# EAGLE design LibreServo-v2.1 (EAGLE 7.6.0)
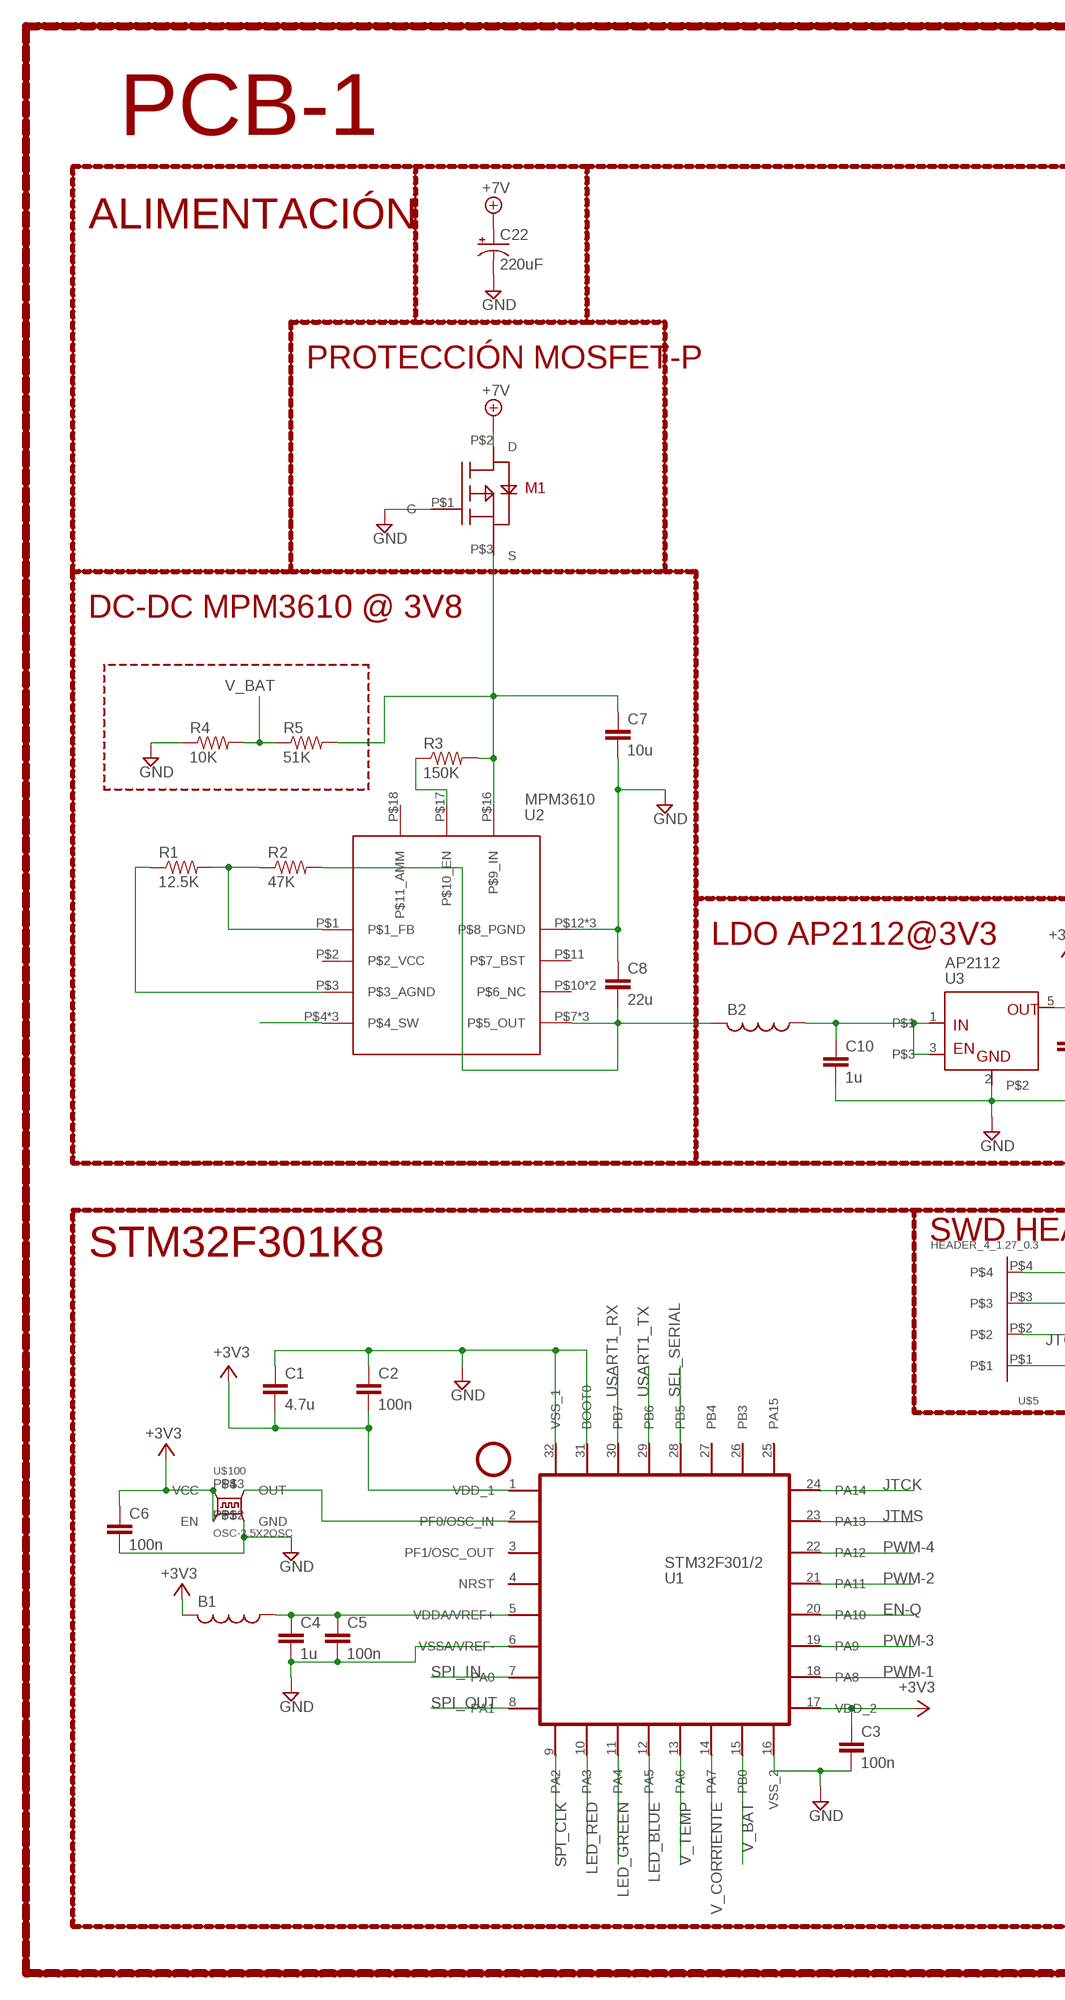
[diagram p0: schematic, sheet 1, part 1 of 2]
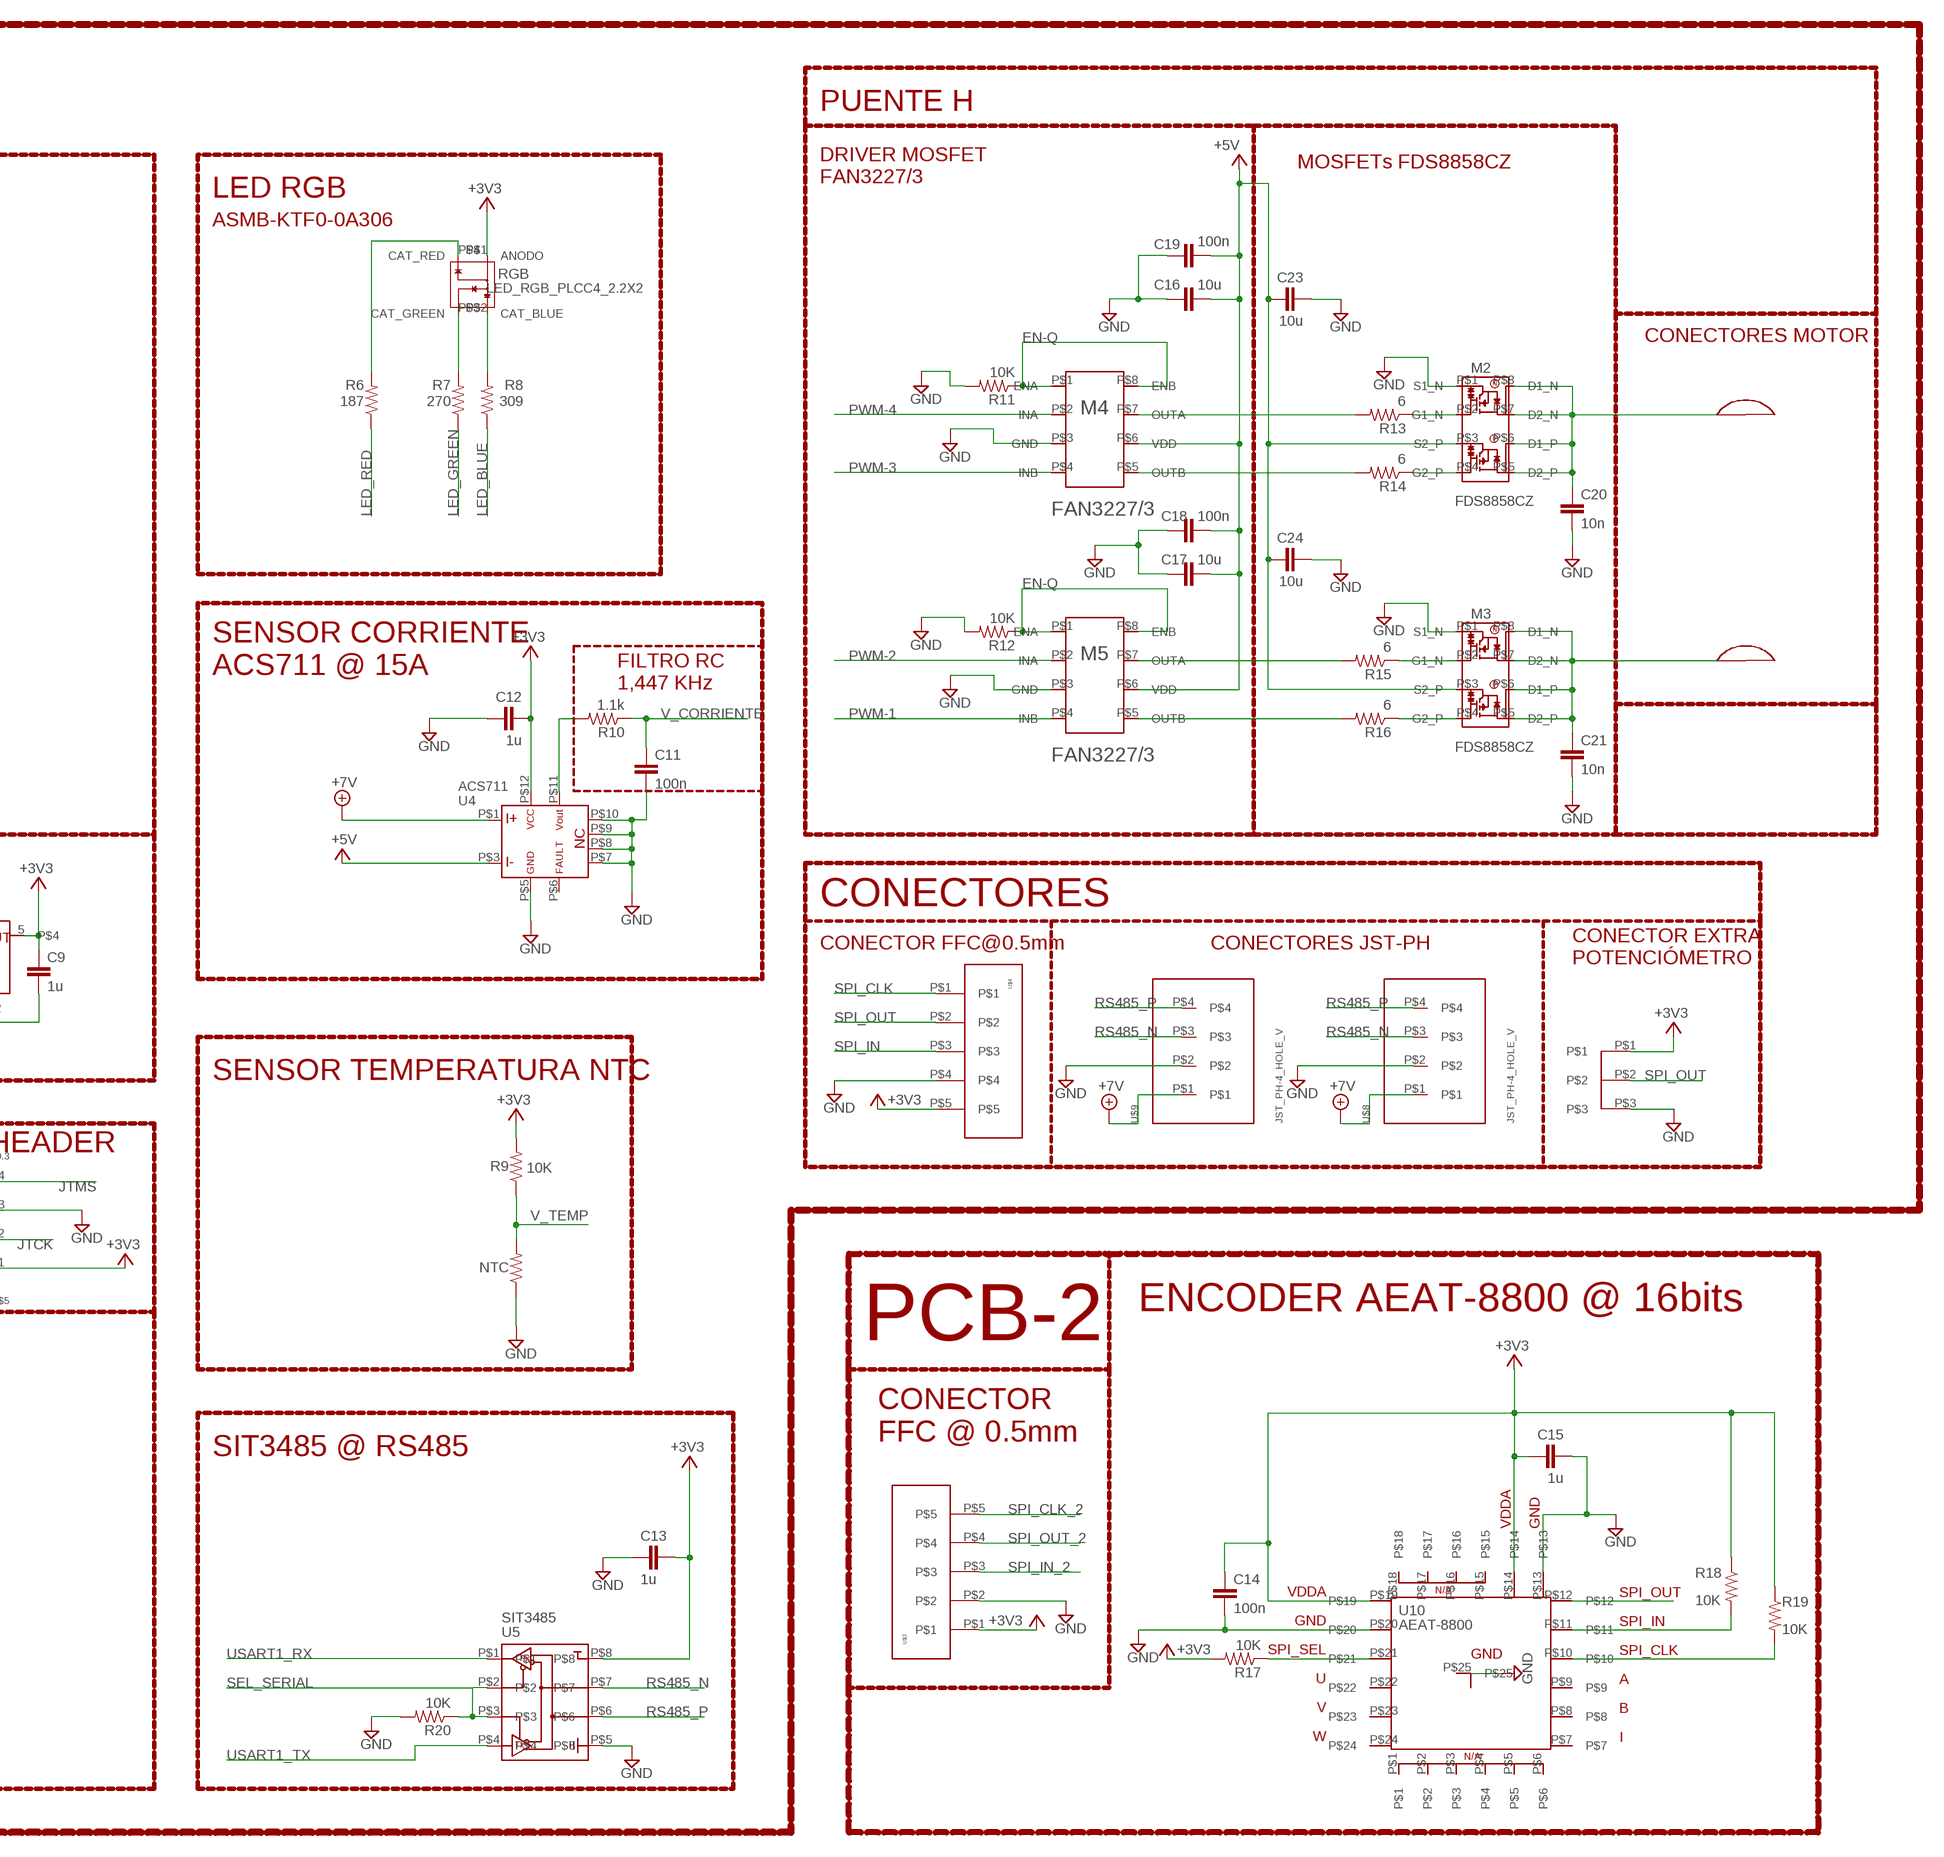
[diagram p1: schematic, sheet 1, part 2 of 2]

## Parts
B1  FERRITE_BEAD_0402  [0402]
B2  FERRITE_BEAD_0603  [0603]
C1  4.7u  C-EU0402  [0402]
C2  100n  C-EU0402  [0402]
C3  100n  C-EU0402  [0402]
C4  1u  C-EU0402  [0402]
C5  100n  C-EU0402  [0402]
C6  100n  C-EU0402  [0402]
C7  10u  C-EU0603  [0603]
C8  22u  C-EU1206  [1206]
C9  1u  C-EU0402  [0402]
C10  1u  C-EU0402  [0402]
C11  100n  C-EU0402  [0402]
C12  1u  C-EU0402  [0402]
C13  1u  C-EU0402  [0402]
C14  100n  C-EU0402  [0402]
C15  1u  C-EU0402  [0402]
C16  10u  C-EU0603  [0603]
C17  10u  C-EU0603  [0603]
C18  100n  C-EU0402  [0402]
C19  100n  C-EU0402  [0402]
C20  10n  C-EU0402  [0402]
C21  10n  C-EU0402  [0402]
C22  220uF  CPOL-USE2.5-6  [E2,5-6]
C23  10u  C-EU0603  [0603]
C24  10u  C-EU0603  [0603]
M1  M1  P5103EMA  [SOT23]
M2  FDS8858CZ  [SO-8]
M3  FDS8858CZ  [SO-8]
M4  FAN3227/3  [MLP8]
M5  FAN3227/3  [MLP8]
NTC  R-US0402_MIN  [0402_MIN]
R1  12.5K  R-US0402  [0402]
R2  47K  R-US0402  [0402]
R3  150K  R-US0402  [0402]
R4  10K  R-US0402  [0402]
R5  51K  R-US0402  [0402]
R6  187  R-US0402  [0402]
R7  270  R-US0402  [0402]
R8  309  R-US0402  [0402]
R9  10K  R-US0402  [0402]
R10  1.1k  R-US0402  [0402]
R11  10K  R-US0402  [0402]
R12  10K  R-US0402  [0402]
R13  6  R-US0402  [0402]
R14  6  R-US0402  [0402]
R15  6  R-US0402  [0402]
R16  6  R-US0402  [0402]
R17  10K  R-US0402  [0402]
R18  10K  R-US0402  [0402]
R19  10K  R-US0402  [0402]
R20  10K  R-US0402  [0402]
RGB  LED_RGB_PLCC4_2.2X2  [PLCC-4_2.2X2]
U1  STM32F301/2  STM32F302  [QFN32]
U2  MPM3610  MPM36XX  [MPM36XX]
U3  AP2112  [SOT25]
U4  ACS711  [ACS711-QFN]
U5  SIT3485  RS485-HALF_DUPLEX  [MSOP-8]
U10  AEAT-8800  [QFN24]
U$1  SLOT  [SERVO_SLOT]
U$2  SLOT  [SERVO_SLOT]
U$3  FFC-5  [FFC-5-0.5]
U$4  FFC-5  [FFC-5-0.5]
U$5  HEADER_4_1.27_0.3  [HEADER_4_1.27_0.3]
U$6  POTEN_SERVO  [POTEN_SERVO]
U$8  JST_PH-4_HOLE_V  [JST_PH-4_HOLEV]
U$9  JST_PH-4_HOLE_V  [JST_PH-4_HOLEV]
U$100  OSC-2.5X2OSC  [OSC-2.5X2]

## Nets
711_OUT: R10.2 U4.P$11
+3V3: B1.2 C1.2 C2.2 C3.1 C6.1 C9.1 C12.2 C13.2 R9.2 RGB.P$1(ANODO) U1.1(VDD_1) U1.17(VDD_2) U3.5 U4.P$12 U5.P$8 U$4.P$5 U$5.P$1 U$6.P$1 U$100.P$1(EN) U$100.P$4(VCC)
+3V3_2: C14.1 C15.1 R17.2 R18.1 R19.1 U10.P$14 U10.P$19 U$3.P$1 ; supply symbol labelled +3V3
+5V: C16.2 C17.2 C18.2 C19.2 C23.1 C24.1 M2.P$3(S2_P) M3.P$3(S2_P) M4.P$6(VDD) M5.P$6(VDD) U4.P$3
+7V: C22.+ M1.P$2(D) U4.P$1 U$8.P$1 U$9.P$1
CLK-8MHZ: U1.2(PF0/OSC_IN) U$100.P$3(OUT)
EN-Q: M4.P$1(ENA) M4.P$8(ENB) M5.P$1(ENA) M5.P$8(ENB) R11.1 R12.1 U1.20(PA10)
GND: C1.1 C2.1 C3.2 C4.2 C5.2 C6.2 C7.2 C8.1 C9.2 C10.2 C11.2 C12.1 C13.1 C16.1 C17.1 C18.1 C19.1 C20.2 C21.2 C22.- C23.2 C24.2 M1.P$1(G) M2.P$1(S1_N) M3.P$1(S1_N) M4.P$3(GND) M5.P$3(GND) NTC.1 R4.1 R11.2 R12.2 R20.2 U1.6(VSSA/VREF-) U1.16(VSS_2) U1.31(BOOT0) U1.32(VSS_1) U2.P$12(P$8_PGND) U2.P$13(P$8_PGND) U2.P$14(P$8_PGND) U3.2 U4.P$5 U4.P$7 U4.P$8 U4.P$9 U4.P$10 U5.P$5 U$4.P$4 U$5.P$3 U$6.P$3 U$8.P$2 U$9.P$2 U$100.P$2(GND)
GND_2: C14.2 C15.2 U10.P$13 U10.P$20 U10.P$25 U$3.P$2 ; supply symbol labelled GND
IN_AP2112: B2.1 C10.1 U3.1 U3.3
JTCK: U1.24(PA14) U$5.P$2
JTMS: U1.23(PA13) U$5.P$4
LED_BLUE: R8.1 U1.12(PA5)
LED_GREEN: R7.1 U1.11(PA4)
LED_RED: R6.1 U1.10(PA3)
M1-OUT: C7.1 M1.P$3(S) R3.2 R5.2 U2.P$16(P$9_IN)
M2-OUT: C20.1 M2.P$5(D2_P) M2.P$6(D1_P) M2.P$7(D2_N) M2.P$8(D1_N) U$1.P$1
M3-OUT: C21.1 M3.P$5(D2_P) M3.P$6(D1_P) M3.P$7(D2_N) M3.P$8(D1_N) U$2.P$1
M4-OUTA: M4.P$7(OUTA) R13.2
M4-OUTA-IN: M2.P$2(G1_N) R13.1
M4-OUTB: M4.P$5(OUTB) R14.2
M4-OUTB-IN: M2.P$4(G2_P) R14.1
M5-OUTA: M5.P$7(OUTA) R15.2
M5-OUTA-IN: M3.P$2(G1_N) R15.1
M5-OUTB: M5.P$5(OUTB) R16.2
M5-OUTB-IN: M3.P$4(G2_P) R16.1
MPM3610_AGND: R1.1 U2.P$3(P$3_AGND)
MPM3610_EN: R3.1 U2.P$17(P$10_EN)
MPM3610_FB: R1.2 R2.1 U2.P$1(P$1_FB)
MPM3610_SW: U2.P$4(P$4_SW) U2.P$5(P$4_SW) U2.P$6(P$4_SW)
N$1: R6.2 RGB.P$4(CAT_RED)
N$4: R7.2 RGB.P$3(CAT_GREEN)
N$5: R8.2 RGB.P$2(CAT_BLUE)
N$17: R17.1 U10.P$21
OUT_MPM3610: B2.2 C8.2 R2.2 U2.P$7(P$5_OUT) U2.P$8(P$5_OUT) U2.P$9(P$5_OUT)
PWM-1: M5.P$4(INB) U1.18(PA8)
PWM-2: M5.P$2(INA) U1.21(PA11)
PWM-3: M4.P$4(INB) U1.19(PA9)
PWM-4: M4.P$2(INA) U1.22(PA12)
RS485_N [Diff]: U5.P$7 U$8.P$3 U$9.P$3
RS485_P [Diff]: U5.P$6 U$8.P$4 U$9.P$4
SEL_SERIAL: R20.1 U1.28(PB5) U5.P$2 U5.P$3
SPI_CLK: U1.9(PA2) U$4.P$1
SPI_CLK_2: R19.2 U10.P$10 U$3.P$5
SPI_IN: U1.7(PA0) U$4.P$3
SPI_IN_2: R18.2 U10.P$11 U$3.P$3
SPI_OUT: U1.8(PA1) U$4.P$2 U$6.P$2
SPI_OUT_2: U10.P$12 U$3.P$4
USART1_RX: U1.30(PB7) U5.P$1
USART1_TX: U1.29(PB6) U5.P$4
V_BAT: R4.2 R5.1 U1.15(PB0)
V_CORRIENTE: C11.1 R10.1 U1.14(PA7)
V_TEMP: NTC.2 R9.1 U1.13(PA6)
VDDA-FILTRADO: B1.1 C4.1 C5.1 U1.5(VDDA/VREF+)
Unconnected: U1.3(PF1/OSC_OUT) U1.4(NRST) U1.25(PA15) U1.26(PB3) U1.27(PB4) U2.P$2(P$2_VCC) U2.P$10(P$6_NC) U2.P$11(P$7_BST) U2.P$15(P$6_NC) U2.P$18(P$11_AMM) U4.P$6 U10.P$1 U10.P$2 U10.P$3 U10.P$4 U10.P$5 U10.P$6 U10.P$7 U10.P$8 U10.P$9 U10.P$15 U10.P$16 U10.P$17 U10.P$18 U10.P$22 U10.P$23 U10.P$24 U$1.P$2 U$2.P$2

## Notes on the sheet
- PUENTE H
- PCB-1
- MOSFETs FDS8858CZ
- DRIVER MOSFET
  FAN3227/3
- LED RGB
- ALIMENTACIÓN
- ASMB-KTF0-0A306
- PROTECCIÓN MOSFET-P | CONECTORES MOTOR
- M1
- DC-DC MPM3610 @ 3V8
- SENSOR CORRIENTE
  ACS711 @ 15A
- FILTRO RC
  1,447 KHz
- LDO AP2112@3V3
- CONECTORES
- CONECTOR FFC@0.5mm | CONECTORES JST-PH
- CONECTOR EXTRA
  POTENCIÓMETRO
- SENSOR TEMPERATURA NTC
- SWD HEADER
- STM32F301K8
- ENCODER AEAT-8800 @ 16bits
- PCB-2
- CONECTOR
  FFC @ 0.5mm
- SIT3485 @ RS485

## Library data of the parts
B1 = Propio:FERRITE_BEAD_0402
B2 = Propio:FERRITE_BEAD_0603
C1-C21 C23 C24 = Propio:C-EU
C22 = rcl:CPOL-US: POLARIZED CAPACITOR, American symbol
M1 = Propio:P5103EMA
M2 M3 = Propio:FDS8858CZ
M4 M5 = Propio:FAN3227/3
NTC R1-R20 = Propio:R-US
RGB = Propio:LED_RGB_PLCC4_2.2X2
U1 = Propio:STM32F302
U2 = Propio:MPM36XX
U3 = Propio:AP2112
U4 = Propio:ACS711
U5 = Propio:RS485-HALF_DUPLEX
U10 = Propio:AEAT-8800
U$1 U$2 = Propio:SLOT
U$3 U$4 = Propio:FFC-5
U$5 = Propio:HEADER_4
U$6 = Propio:POTEN_SERVO
U$8 U$9 = Propio:JST_PH-4_HOLE
U$100 = Propio:OSC-2.5X2

## Net classes
1 Diff: width 0.178 mm, clearance 0.152 mm

## Board
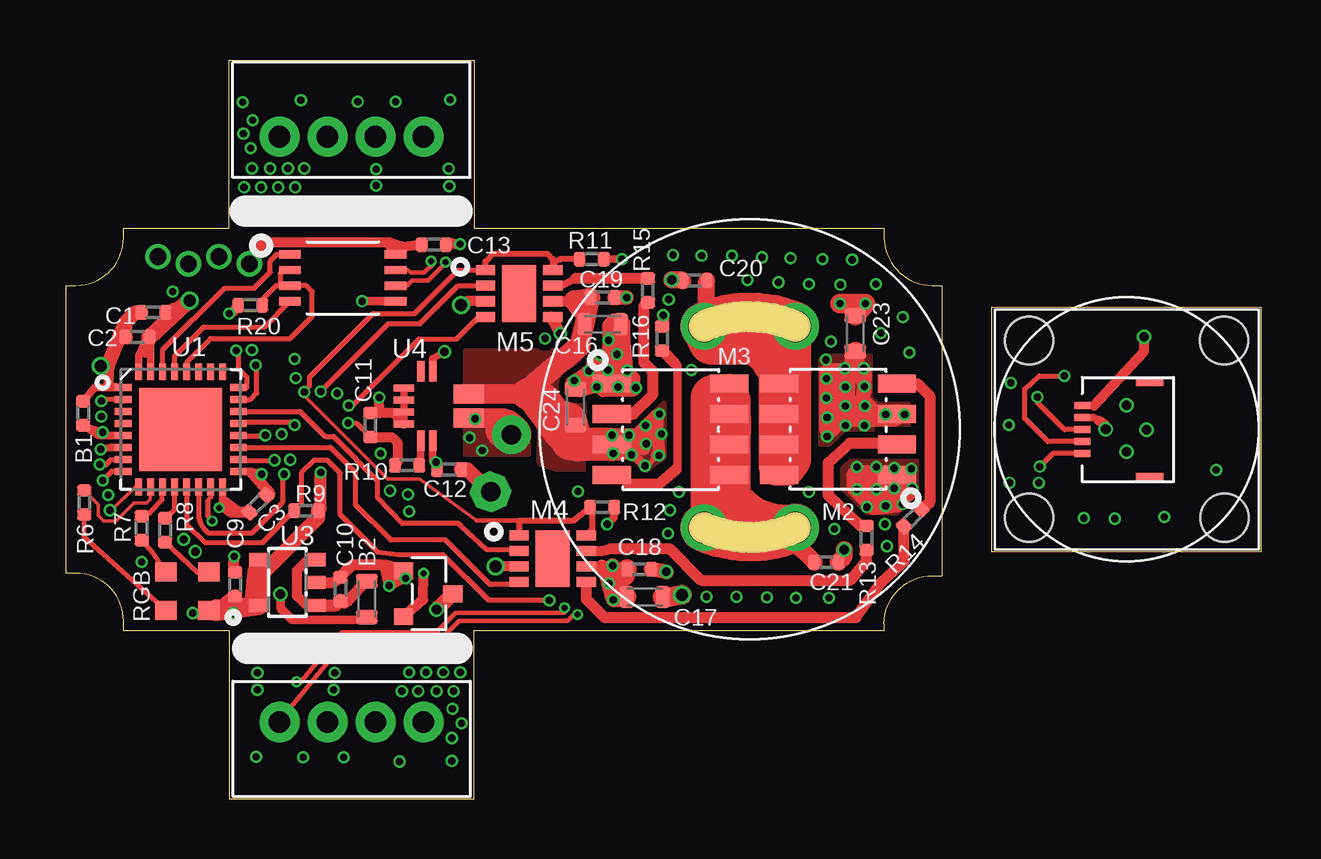
[diagram p2: board, top side]
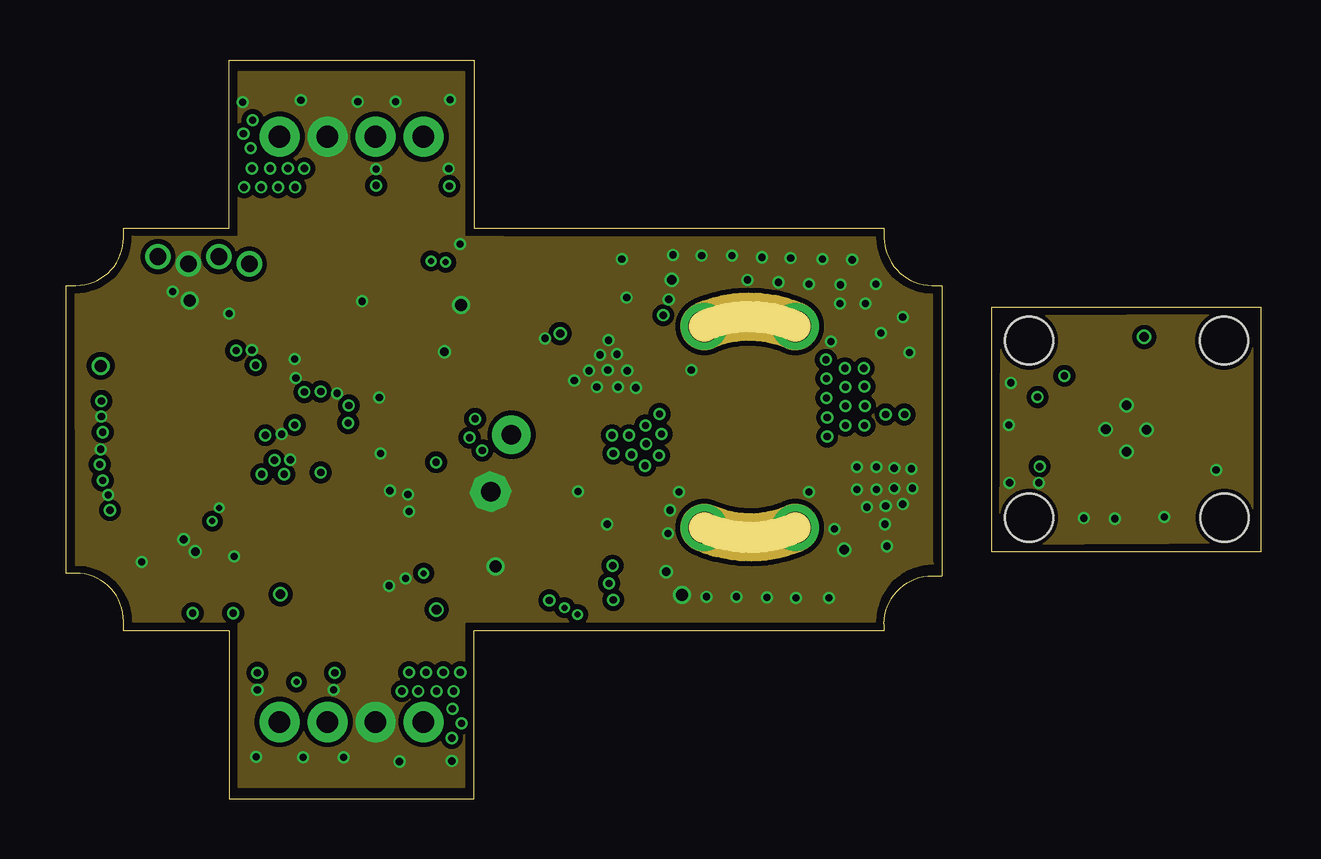
[diagram p3: board, inner layer Route2]
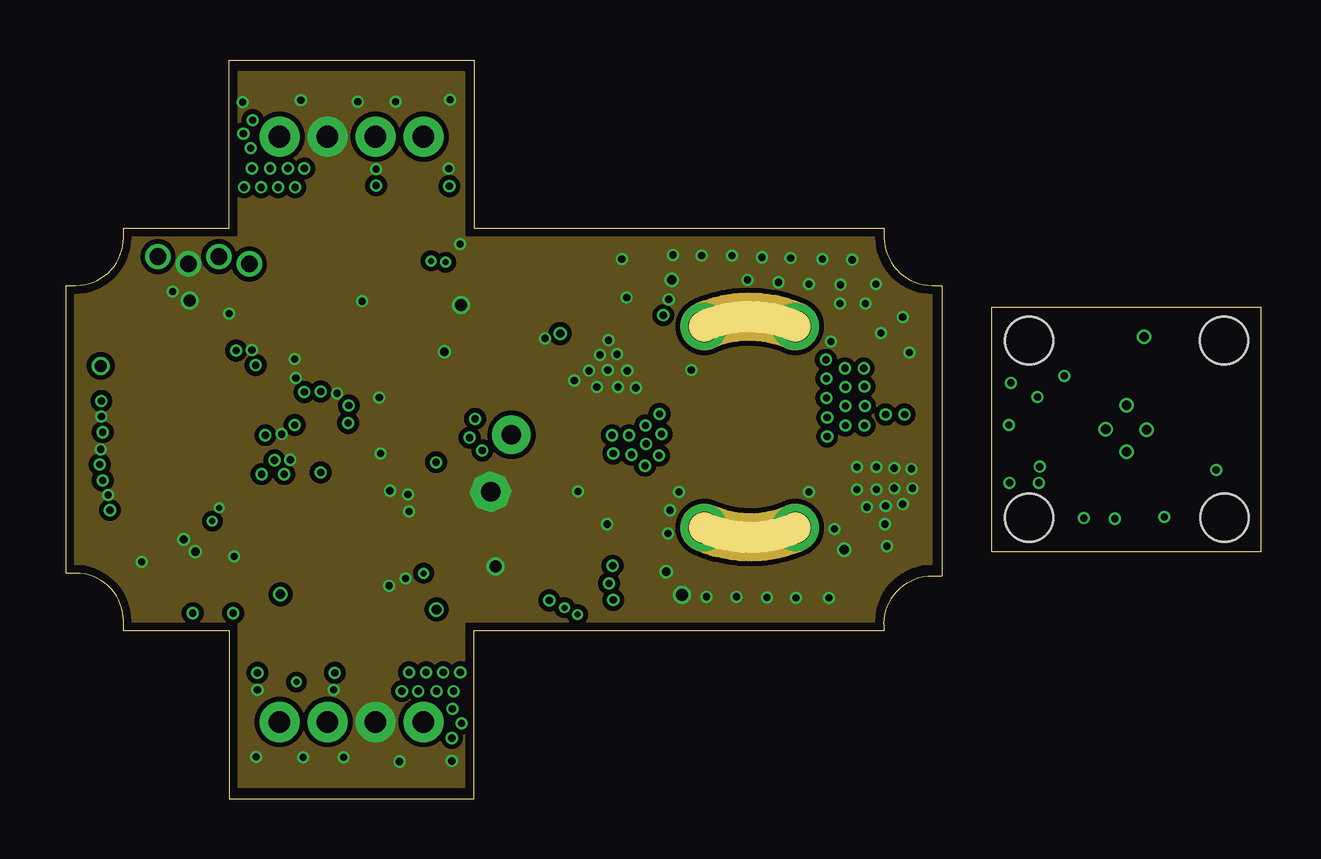
[diagram p4: board, inner layer Route3]
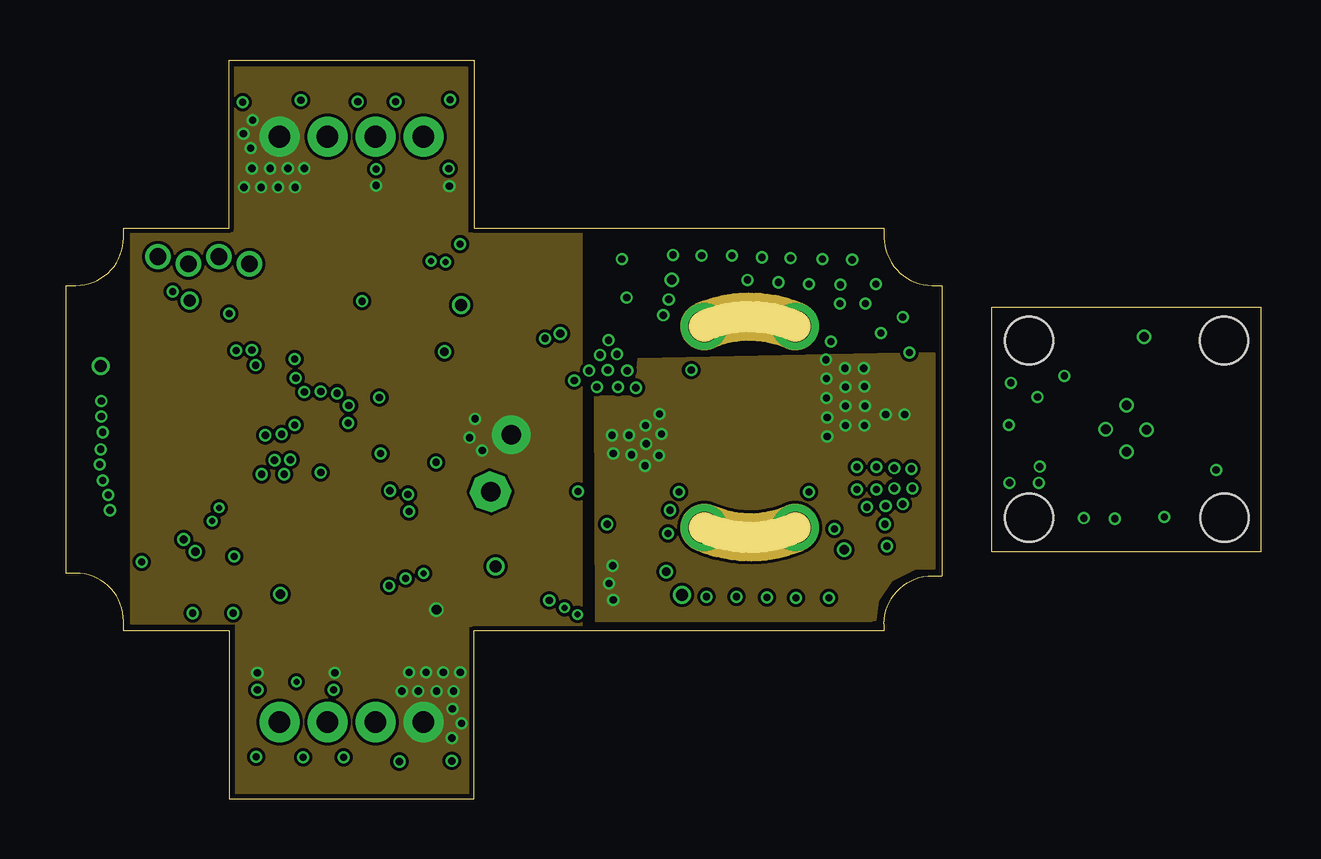
[diagram p5: board, inner layer Route14]
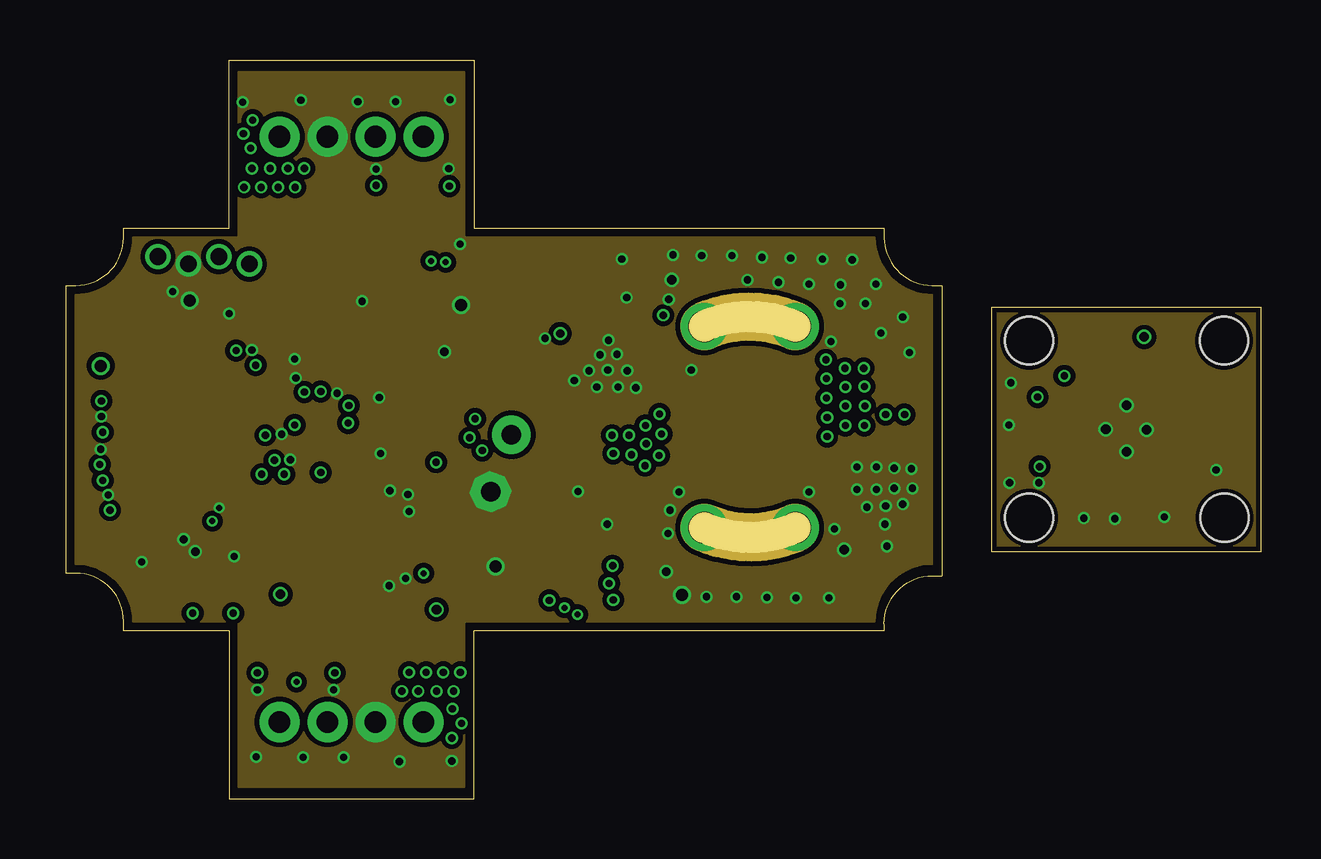
[diagram p6: board, inner layer Route15]
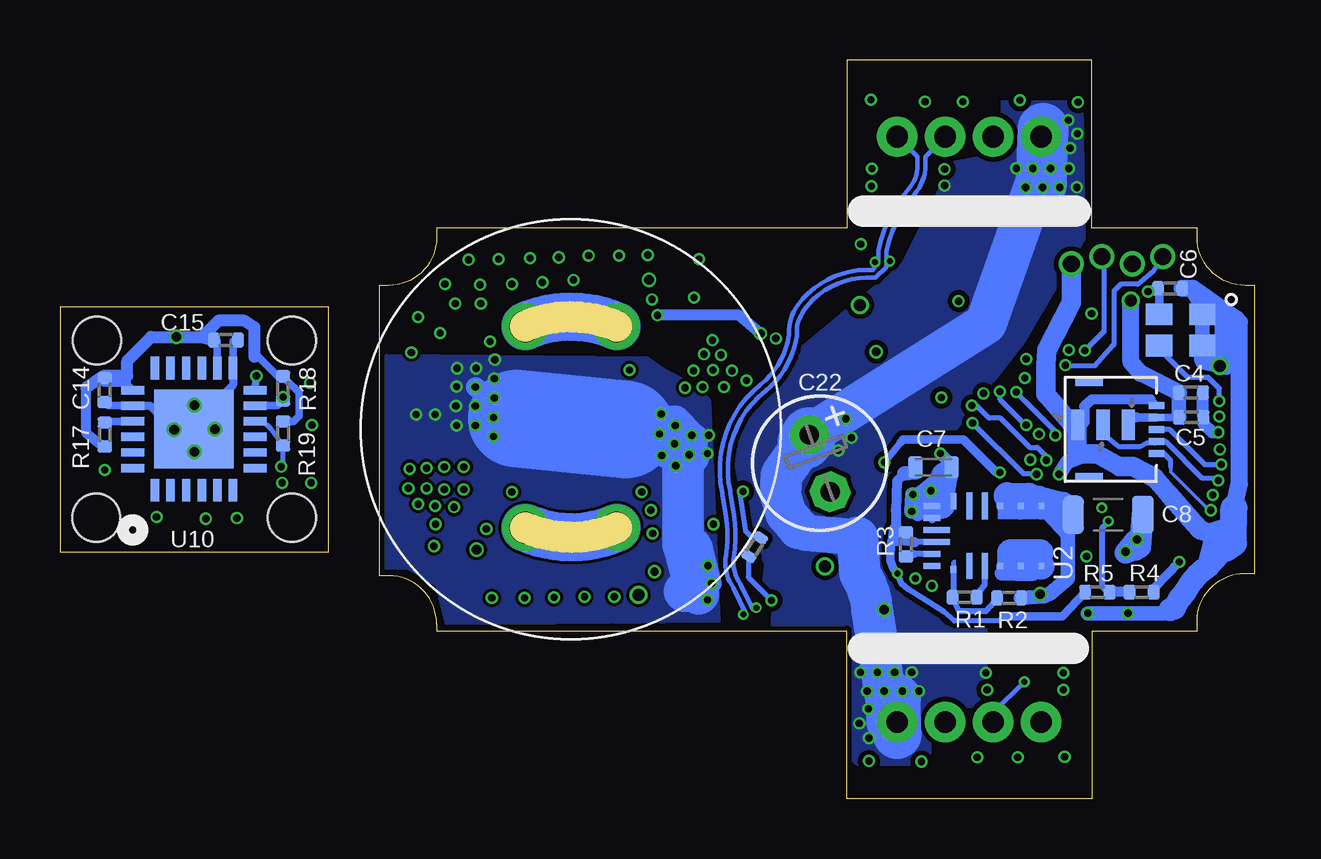
[diagram p7: board, bottom side, seen from below]

Size 49.8 x 30.8 mm. Coordinates in mm from the lower left corner, seen from the top.
Outline: 2.4,7.4 arc90 0.4,9.4 0,9.4 0,21.4 0.4,21.4 arc90 2.4,23.4 2.4,23.8 6.8,23.8 6.8,30.8 17,30.8 17,23.8 34.1,23.8 34.1,23.4 arc90 36.1,21.4 36.5,21.4 36.5,9.3 36.1,9.3 arc90 34.1,7.3 34.1,7 17,7 17,0 6.8,0 6.8,7 2.4,7 2.4,7.4
Outline: 38.6,20.5 49.8,20.5 49.8,10.3 38.6,10.3 38.6,20.5
Copper layers (1+2*3+14*15+16): Top 0.035mm / dielectric 0.0994mm / Route2 0.0152mm / dielectric 0.3196mm / Route3 0.0152mm / dielectric 0.1088mm / Route14 0.0152mm / dielectric 0.3196mm / Route15 0.0152mm / dielectric 0.0994mm / Bottom 0.035mm
Design rules "jlcpcb_6_layer": minimum track width 5mil, minimum drill 0.25mm, track to track 0.126490625mm, track to pad 0.126490625mm, pad to pad 0.126490625mm, via to via 0.126490625mm, smd to smd 0mil, copper to edge 0.2mm, drill to drill 5mil, minimum pad ring 4mil, minimum via ring 4mil, stop-mask expansion 3mil, vias tented up to drill 100mil, thermal gap 10mil
Holes 2 mm at 40.14,11.71 40.14,19.1 48.27,19.1 48.29,11.71

### Footprints (pad centres in the part's own frame; a part is rotated, then mirrored left to right if it is on the bottom)
0402 = smd 0.5 x 0.6: 1 -0.5,0; 2 0.5,0
0603 = smd 0.6 x 0.9: 1 -0.75,0; 2 0.75,0
1206 = smd 0.9 x 1.6: 1 -1.45,0; 2 1.45,0
E2,5-6 = drill 0.813 pad 1.6: + -1.27,0 | drill 0.813 pad 1.6 octagon: - 1.27,0
SOT23 = smd 0.7 x 0.8: P$1 -0.95,-1.25; P$2 0,0.8; P$3 0.95,-1.25
SO-8 = smd 1.6 x 0.75: P$1 -2.45,1.905; P$2 -2.45,0.635; P$3 -2.45,-0.635; P$4 -2.45,-1.905; P$5 2.45,-1.905; P$6 2.45,-0.635; P$7 2.45,0.635; P$8 2.45,1.905
MLP8 = smd 0.8 x 0.42: P$1 -1.4,0.975; P$2 -1.4,0.325; P$3 -1.4,-0.325; P$4 -1.4,-0.975; P$5 1.4,-0.975; P$6 1.4,-0.325; P$7 1.4,0.325; P$8 1.4,0.975 | smd 1.42 x 2.37: P$9 0,0
0402_MIN = smd 0.4 x 0.6: 1 -0.45,0; 2 0.45,0
PLCC-4_2.2X2 = smd 0.9 x 0.8: P$1 -0.9,0.8; P$2 -0.9,-0.8; P$3 0.9,-0.8; P$4 0.9,0.8
QFN32 = smd 0.3 x 0.7: 1 -1.75,-2.4; 2 -1.25,-2.4; 3 -0.75,-2.4; 4 -0.25,-2.4; 5 0.25,-2.4; 6 0.75,-2.4; 7 1.25,-2.4; 8 1.75,-2.4; 17 1.75,2.4; 18 1.25,2.4; 19 0.75,2.4; 20 0.25,2.4; 21 -0.25,2.4; 22 -0.75,2.4; 23 -1.25,2.4; 24 -1.75,2.4 | smd 0.7 x 0.3: 9 2.4,-1.75; 10 2.4,-1.25; 11 2.4,-0.75; 12 2.4,-0.25; 13 2.4,0.25; 14 2.4,0.75; 15 2.4,1.25; 16 2.4,1.75; 25 -2.4,1.75; 26 -2.4,1.25; 27 -2.4,0.75; 28 -2.4,0.25; 29 -2.4,-0.25; 30 -2.4,-0.75; 31 -2.4,-1.25; 32 -2.4,-1.75 | smd 3.45 x 3.45: EP 0,0
MPM36XX = smd 0.3 x 0.25: P$1 -1.4,1.55; P$4 -1.25,-0.4; P$5 -1.25,-1.25; P$6 -1.25,-2.1; P$7 1.25,-2.1; P$8 1.25,-1.25; P$9 1.25,-0.4 | smd 1.1 x 0.25: P$2 -1.25,0.9; P$3 -1.25,0.25 | smd 1.125 x 0.25: P$10 1.25,0.25; P$11 1.25,0.9 | smd 0.7 x 0.25: P$12 1.45,1.55 | smd 0.25 x 0.7: P$13 1.25,2.45; P$14 0.75,2.45; P$17 -0.75,2.45; P$18 -1.25,2.45 | smd 0.25 x 1.1: P$15 0.25,2.25; P$16 -0.25,2.25
SOT25 = smd 0.55 x 0.8: 1 -0.95,-1.2; 2 0,-1.2; 3 0.95,-1.2; 4 0.95,1.2; 5 -0.95,1.2
ACS711-QFN = smd 1.27 x 0.8: P$1 0,0.5; P$3 0,-0.5 | smd 0.3 x 0.85: P$5 1.5,-1.45; P$6 2,-1.45; P$11 2,1.45; P$12 1.5,1.45 | smd 0.85 x 0.3: P$7 2.7,-0.75; P$8 2.7,-0.25; P$9 2.7,0.25; P$10 2.7,0.75
MSOP-8 = smd 0.9 x 0.35: P$1 -2.2,0.975; P$2 -2.2,0.325; P$3 -2.2,-0.325; P$4 -2.2,-0.975; P$5 2.2,-0.975; P$6 2.2,-0.325; P$7 2.2,0.325; P$8 2.2,0.975
QFN24 = smd 0.95 x 0.35: P$1 -2.55,1.625; P$2 -2.55,0.975; P$3 -2.55,0.325; P$4 -2.55,-0.325; P$5 -2.55,-0.975; P$6 -2.55,-1.625; P$13 2.55,-1.625; P$14 2.55,-0.975; P$15 2.55,-0.325; P$16 2.55,0.325; P$17 2.55,0.975; P$18 2.55,1.625 | smd 0.35 x 0.95: P$7 -1.625,-2.55; P$8 -0.975,-2.55; P$9 -0.325,-2.55; P$10 0.325,-2.55; P$11 0.975,-2.55; P$12 1.625,-2.55; P$19 1.625,2.55; P$20 0.975,2.55; P$21 0.325,2.55; P$22 -0.325,2.55; P$23 -0.975,2.55; P$24 -1.625,2.55 | smd 3.3 x 3.3: P$25 0,0
SERVO_SLOT = drill 1.3: P$1 -1.9,4.2; P$2 1.9,4.2
FFC-5-0.5 = smd 0.3 x 0.65: P$1 -1,0; P$2 -0.5,0; P$3 0,0; P$4 0.5,0; P$5 1,0 | smd 0.3 x 1.15: P$6 -1.96,2.81; P$7 1.96,2.81
HEADER_4_1.27_0.3 = drill 0.7 pad 1.016: P$1 -2.54,0; P$2 -1.27,0.3; P$3 0,0; P$4 1.27,0.3
POTEN_SERVO = smd 0.55 x 1.27: P$1 -1.05,0; P$2 0,0; P$3 1.05,0
JST_PH-4_HOLEV = drill 0.9 pad 1.676: P$1 -3,0; P$2 -1,0; P$3 1,0; P$4 3,0
OSC-2.5X2 = smd 0.9 x 1.1: P$1 -0.65,0.9; P$2 -0.65,-0.9; P$3 0.65,-0.9; P$4 0.65,0.9

### Placement (x,y rotation side)
B1  0.71,16.07 90 top
B2  12.54,8.33 270 top
C1  3.64,20.28 180 top
C2  2.98,19.25 180 top
C3  8,12.3 225 top
C4  2.67,16.93 180 bottom
C5  2.64,15.91 180 bottom
C6  3.53,21.27 180 bottom
C7  13.39,13.82 0 bottom
C8  6.12,11.84 180 bottom
C9  7.05,8.93 90 top
C10  11.44,8.74 90 top
C11  12.69,15.58 90 top
C12  15.96,13.72 180 top
C13  15.33,23.1 180 top
C14  47.93,17.04 270 bottom
C15  42.88,19.12 0 bottom
C16  22.37,19.78 180 top
C17  24.12,8.41 180 top
C18  23.89,9.57 180 top
C19  22.36,20.89 180 top
C20  26.2,21.6 180 top
C21  31.69,9.86 0 top
C22  18.13,13.98 290 bottom
C23  32.89,19.4 90 top
C24  21.23,16.32 90 top
M1  15.32,8.54 270 top
M2  32.18,15.4 180 top
M3  25.2,15.4 0 top
M4  20.29,10.01 0 top
M5  18.89,21.06 0 top
NTC  20.84,10.49 238 bottom
R1  12.09,8.4 180 bottom
R2  10.24,8.37 0 bottom
R3  14.54,10.6 90 bottom
R4  4.72,8.61 180 bottom
R5  6.56,8.61 180 bottom
R6  0.76,12.35 270 top
R7  3.16,11.28 270 top
R8  4.13,11.2 270 top
R9  10.01,12.01 0 top
R10  14.21,13.9 0 top
R11  21.91,22.5 0 top
R12  22.34,12.15 0 top
R13  33.36,10.87 270 top
R14  35.28,11.71 225 top
R15  24.25,21.2 90 top
R16  24.84,19.19 90 top
R17  47.93,15.18 270 bottom
R18  40.51,17.11 270 bottom
R19  40.5,15.23 270 bottom
R20  7.68,20.58 180 top
RGB  5.06,8.65 180 top
U1  4.78,15.4 270 top
U2  11,10.96 90 bottom
U3  9.22,9.02 90 top
U4  16.79,16.37 180 top
U5  11.54,21.72 0 top
U10  44.21,15.41 90 bottom
U$1  28.5,15.5 0 top
U$2  28.5,15.5 180 top
U$3  42.36,15.39 270 top
U$4  4.1,15.4 90 bottom
U$5  5.1,22.3 0 bottom
U$6  6.32,15.59 0 bottom
U$8  11.9,3.2 180 top
U$9  11.9,27.6 0 top
U$100  3.08,19.54 270 bottom

### Tracks (layer width: path | path; a pad name or v marks a point on that pad's centre or on a via)
711_OUT
  Top 0.305: U4.P$11 14.79,14.07 R10.2
+3V3  (via drill 0.3, 0.5)
  Top 0.203: 15.29,15.18 15.29,14.15 v15.43,14.03
  Top 0.254: 7.68,13.65 8.03,13.65 v8.15,13.53
  Top 0.305: B1.2 1.19,17.15 U1.1 1.78,17.22 | C12.2 15.29,14.07 | 15.29,14.07 U4.P$12 | U1.17 7.68,13.65 7.75,13.58 | 15.29,14.07 15.37,14.02 v15.43,14.03
  Top 0.356: 13.89,22.98 U5.P$8 13.39,23.19
  Top 0.406: 1.83,17.21 1.78,17.22 1.83,18.28 1.73,18 | 2.41,19.75 C2.2 | C13.2 13.89,22.98 | U$5.P$1 7.64,22.56 8.28,23.2 13.46,23.2 14.1,23 13.39,23.19
  Top 0.457: 7.75,13.58 8.51,12.72 C3.1 | RGB.P$1 5.95,7.88 arc-90 v6.96,7.74 6.12,7.66 v5.28,7.74 | U3.5 7.9,8.16
  Top 0.508: R9.2 10.62,12.11 v10.62,13.6
  Top 0.61: 1.83,18.28 2.41,19.75 | v1.45,18.05 1.73,18 | 6.27,7.81 C9.1 | C1.2 2.89,20.28 2.46,19.85 2.46,19.26 C2.2 | 8.03,9.46 8.26,9.46 10.52,11.72 R9.2
  Top 0.66: 6.27,7.91 v6.96,7.74
  Top 0.813: U3.5 6.27,7.81 6.27,7.91
  Top 0.914: 7.9,8.16 8.03,9.46
  Bottom 0.203: 1.64,10.75 1.86,10.97 2.02,11.14
  Bottom 0.305: C6.1 2.7,21.09 U$100.P$1 | 8.18,13.55 v8.15,13.53 | v15.43,14.03 14.76,14.87 | U$4.P$5 4.35,16.65
  Bottom 0.356: 14.76,14.87 14.66,14.98 12.14,14.98 10.77,13.6 v10.62,13.6
  Bottom 0.406: 4.35,16.65 6.78,16.65 7.11,16.37 7.11,15.65 U$6.P$1
  Bottom 0.457: v8.15,13.53 8.1,13.58
  Bottom 0.559: 7.41,15.37 U$6.P$1 | 7.16,14.29 7.41,14.38
  Bottom 0.61: 2.13,18.33 v1.45,18.05 2.18,18.2 | U$100.P$1 U$100.P$4 | v6.96,7.74 3.81,7.74 3.53,7.89 | 1.22,17.97 1.17,18.02 | 8.1,13.58 7.82,14.01 7.16,14.29 | 1.27,11.39 2.02,11.14 1.91,11.09
  Bottom 0.711: 0.86,12.11 0.64,13.12 0.64,19.85 0.76,20.01 | 1.17,18.02 1.32,18.18 1.32,20.16 0.76,20.01 | 0.76,20.01 2.56,21.27 C6.1
  Bottom 0.762: 5.64,13.86 6.58,14.37
  Bottom 0.813: U$100.P$4 2.13,18.33 | 5.64,13.86 5.08,13.86 4.17,13.38 3.53,12.64 2.52,11.47 2.26,11.22 1.91,11.09 | 6.58,14.37 7.41,14.38 7.41,15.37 8.71,16.88 8.71,18.1 8.66,18.71 7.64,20.69 U$5.P$1
  Bottom 0.9: 1.92,9.7 1.21,10.44
  Bottom 0.965: 1.64,10.75 1.92,9.7 arc-27 2.82,8.75 arc15 3.15,8.32 3.35,7.94 3.53,7.89
  Bottom 1.118: 1.21,10.44 0.89,10.66 0.86,12.11
+3V3_2  (via drill 0.4)
  Top 0.305: U$3.P$1 42.85,16.39
  Top 0.406: 42.85,16.39 44.93,18.65 44.94,18.65 v44.94,19.25
  Bottom 0.203: 40.38,17.48 40.38,17.49 R18.1 40.53,17.63 40.74,17.63
  Bottom 0.305: U10.P$14 43.24,19.08 C15.1 | 40.38,17.48 39.83,16.93 39.83,15.97 40.07,15.73 R19.1 | 47.26,17.54 U10.P$19 47,17.27 47,17.64 | R17.2 48.02,14.68 | 47.97,17.64 C14.1 | 40.74,17.63 41.53,18.43 41.69,18.43
  Bottom 0.406: 48.02,14.68 48.7,15.23 48.7,17.13
  Bottom 0.508: 48.7,17.13 47.97,17.64 | 47,17.64 47,18.25 46,19.25 v44.94,19.25 43.87,19.25 | 43.87,19.25 C15.1 | 41.69,18.43 41.69,19.65 42.12,19.93 43.19,19.93 43.87,19.25
  Bottom 0.711: C14.1 47.26,17.54
+5V  (via drill 0.3)
  Top 0.203: 24.61,14.34 24.23,13.86 23.75,14.39 | 23.22,14.39 v23.57,14.34 23.75,14.39 | 23.75,14.39 23.85,14.39 24.08,14.62
  Top 0.356: v24.13,13.88 v23.57,14.34
  Top 0.406: M4.P$6 22.33,9.67 | M5.P$6 21.03,20.74
  Top 0.457: 31.8,15.41 31.77,15.41 v31.73,15.1 | v31.73,15.89 31.83,15.91 32.31,15.91 32.46,15.91 v32.49,16.37 | 33.5,16.2 33.45,16.2 v33.27,15.56 | 32.51,17.21 32.56,17.9 v32.46,17.95 | v31.7,17.52 31.8,17.54 | 31.8,17.39 31.8,16.96 v31.7,16.7 | v33.25,17.95 33.22,17.46 33.2,17.59
  Top 0.483: 21.03,20.74 21.03,20.77 | 22.61,9.41 22.63,9.39
  Top 0.508: 24.61,15.81 v24.71,14.32 24.61,14.34 | 22.78,14.39 23.04,14.37 23.01,14.39 23.22,14.39 v22.81,14.39 | 24.56,15 v24.82,15.2 | v24.74,16.04 24.59,15.79
  Top 0.559: 20.68,15.36 20.76,15.39 | 20.76,15.39 C24.1 | 20.85,15.69 20.76,15.39
  Top 0.61: 22.63,9.39 22.68,9.29 | 21.03,20.77 21.16,20.89 C19.2 | 22.33,9.67 22.61,9.41 22.63,9.41 v22.78,9.72 | M3.P$3 22.71,15.15 v22.76,15.15 v23.47,15.15 23.82,15.15 | 23.82,15.15 24.61,15.94 24.61,15.81 24.59,15.79 | 24.08,14.62 24.08,14.87 24.21,15 | 24.21,15 23.82,15 23.65,14.82 | 23.01,14.39 22.78,14.39 | 23.82,15.15 23.88,15.15 | 24.21,15 24.56,15 | 33.2,17.59 v33.27,17.19 33.2,16.5 | v22.81,8.29 23.02,8.37 C17.2 | v22.63,8.98 22.59,9.01 22.77,9.19 | 21.41,15.08 20.85,15.69
  Top 0.813: 22.77,9.19 22.68,9.29 23.31,9.29 C18.2 | 22.94,8.5 C17.2 | C19.2 21.41,20.44 21.16,20.77 21.84,20.89 C16.2 21.41,18.89 | M2.P$3 34.51,15.91 32.31,15.91 31.8,15.41 31.8,17.39 31.8,17.54 31.8,17.74 32.79,17.8 | 32.79,17.8 33.2,17.64 33.2,17.59 | 33.2,16.5 33.5,16.2 32.66,16.2 32.46,16.4 v32.49,17.16 32.46,17.16 32.51,17.21 | U4.P$3 19.24,16.88 19.09,16.94 | 32.79,17.8 C23.1
  Top 0.914: 19.09,16.94 21.41,18.89
  Top 1.016: 22.77,9.19 22.94,8.5 | 21.29,14.77 21.06,14.98
  Top 1.321: 19.24,16.88 19.79,16.58
  Top 1.372: M3.P$3 21.29,14.77
  Top 1.626: 19.79,16.58 20.22,16.02
  Top 1.651: 20.22,16.02 20.68,15.36
  Top 1.727: 21.06,14.98 20.85,15.69
  Bottom 0.305: 23.16,9.97 23.16,9.95 v22.78,9.72
  Bottom 0.813: 30.78,15.84 v32.49,17.16 | 23.19,8.54 23.05,8.54 v22.63,8.98
  Bottom 1.016: v24.82,15.2 23.34,15.08 23.32,15.1 23.32,14.29 24.54,14.29 24.59,14.34 v24.82,15.2 | v24.82,15.2 24.59,15.81 24.64,15.87 24.11,15.87 23.34,15.1 24.51,15.1 24.4,15.03
  Bottom 1.727: 23.6,10.35 23.82,10.61 23.82,14.26 v23.57,14.34 | 23.29,9.13 23.77,8.65 23.3,8.65 23.19,8.54
  Bottom 2.032: 23.6,10.35 23.29,9.13
  Bottom 2.54: 26.2,15.4 v24.82,15.2
  Bottom 4.064: 30.78,15.84 26.2,15.4
  other vias: 33.3,16.37 32.49,15.56 34.16,16.02 34.95,16.02 31.67,18.3 24.16,15.56 24.18,14.8
  pour Top (isolate 0.254, rank 2, no thermals): 16.64,16.58 16.64,18.68 21.82,18.68 21.77,15.38 23.65,15.38 24.94,16.52 24.94,14.21 24.18,13.65 23.57,14.14 21.56,14.16 21.59,13.71 20.42,13.73 19.76,13.93 18.75,16.58
  pour Bottom (no thermals): 24.6,17.9 25.3,18.4 36.2,18.5 36.2,9.6 35.3,9.6 34.1,8.9 33.7,7.3 22.3,7.4 22.7,16.6 23.1,17.1
  pour Route14 (no thermals): 22.1,7.41 33.54,7.41 33.74,7.46 33.85,8.26 34.4,9.1 35.4,9.6 36.2,9.6 36.2,18.56 34.85,18.56 23.85,18.33 23.7,16.78 22.05,16.78
  pour Top (no thermals): 31.42,14.75 31.42,18.3 31.6,18.48 33.55,18.48 33.55,17.26 33.55,16.75 33.83,16.47 35.13,16.47 35.13,15.59 33.66,15.59 33.66,15.38 32.46,15.38 32.21,15.13 31.83,14.75
+7V  (via drill 0.3, 0.4)
  Top 0.61: M1.P$2 | M1.P$2 v15.44,7.89
  Top 0.762: 18.29,15.41 17.92,15.88
  Top 0.813: 18.24,15.88 17.92,15.88 U4.P$1
  Top 1.651: C22.+ 18.29,15.41
  Bottom 0.203: 16.46,9.39 16.59,8.8 16.2,8.63
  Bottom 0.61: v15.44,7.89 16.2,8.63
  Bottom 1.016: 18.69,11.09 19.02,11.27
  Bottom 1.524: 16.56,10.89 18.69,11.09
  Bottom 1.727: U$9.P$1 8.71,27.6 8.71,26.85 11.2,19.8 C22.+ | U$8.P$1 15.34,3.2 15.34,3.94 15.95,7.94 arc-28 16.46,9.39 16.56,10.89 | 19.02,11.27 19.53,11.9 19.76,12.69 19.74,13.5 18.75,14.9
  Bottom 2.032: 14.91,2.67 14.94,4.19
  Bottom 2.134: 8.89,25.64 8.81,27.95
  Bottom 2.286: 18.75,14.9 C22.+
  other vias: 15.01,5.27 15.72,5.27 16.43,5.27 7.42,25.49 8.84,25.49 9.55,25.49 8.13,25.49 7.77,28.29 7.7,27.12 14.3,5.27 16.1,3.75 16.08,2.53 12.93,25.57 15.98,25.54 7.98,5.25 11.2,5.25 7.39,27.73 16.48,3.14 16.15,4.49 15.44,4.49 14,4.49 14.68,4.49 7.75,26.28 8.51,26.28 9.25,26.28 9.93,26.28 17.04,15.84 16.81,15.05 17.35,14.52
  pour Bottom (isolate 0.203, no thermals): 7.19,29.09 10.54,29.06 10.54,26.93 12.57,26.55 14.67,22.33 22.05,16.21 21.21,11.49 20.4,9.77 20.52,8.83 20.09,8.4 20.12,7.38 20.12,7.25 16.99,7.25 16.84,7.16 16.81,1.62 16.56,1.42 13.94,1.42 13.54,1.83 13.54,3.45 13.18,3.81 11.18,3.83 11.18,7.18 12.9,7.2 15.37,9.77 15.01,13.1 15.39,14.26 14.88,15.18 12.65,15.15 9.65,18.99 7.11,23.33
  pour Route14 (no thermals): 7.04,30.47 7.04,23.59 2.72,23.59 2.72,7.3 7.09,7.3 7.09,0.22 16.76,0.22 16.76,7.2 21.49,7.2 21.49,23.56 16.71,23.56 16.71,30.47
  pour Top (no thermals): 16.61,16.17 16.61,14.34 19.3,14.34 19.3,15.36 18.49,16.17
CLK-8MHZ  (via drill 0.3)
  Top 0.203: U1.2 1.62,16.65 v1.47,16.58
  Bottom 0.203: v1.47,16.58 1.47,17.11 1.93,17.57 2.79,17.57 3.73,18.5 U$100.P$3
EN-Q  (via drill 0.3)
  Top 0.152: 9.8,16.83 v9.93,16.96 9.93,16.8 13.41,13.32 14.73,13.32 17.12,11.6
  Top 0.178: 17.12,11.6 18.9,11.6 18.9,11.49
  Top 0.203: U1.20 7.2,15.13 8.28,15.13 v8.31,15.15 | M5.P$1 16.33,22.04 14.53,20.23 12.8,20.23 10.13,17.57 10.13,17.21 v9.93,16.96
  Top 0.254: M5.P$1 17.48,22.4 17.8,22.72 20.07,22.72 20.29,22.5 M5.P$8 arc-90 20.61,22.49 R11.1 | 18.89,10.93 18.9,11.49 18.9,11.6 21.16,11.6 R12.1 | 21.92,12.08 21.92,11.22 M4.P$8
  Top 0.305: M4.P$1 18.89,10.93 | R12.1 21.92,12.08
  Bottom 0.203: v9.93,16.96 9.55,16.55 8.31,15.31 v8.31,15.15
GND  (via drill 0.25, 0.3, 0.35, 0.4, 0.5)
  Top 0.203: 6.53,12.61 7.34,12 v6.38,12.13
  Top 0.305: U1.31 3.53,18.96 | 3.53,18.96 3.3,18.69 | U1.32 3.03,18.47 3.17,18.79 3.45,18.63 3.53,18.96 | 12.94,16.08 C11.2 | U4.P$10 U4.P$9 U4.P$8 U4.P$7 | U1.16 6.53,12.61 6.53,12.23 | U1.6 1.83,14.65 v1.45,14.57 | U4.P$5 15.29,18.35 v15.77,18.63 | R11.2 22.76,22.49 v23.16,22.49 | M1.P$1 13.46,8.78 v14.15,9.18 | R12.2 22.84,11.73 v22.55,11.45
  Top 0.356: C9.2 7,9.68 | v12.35,20.74 U5.P$5
  Top 0.406: C13.1 16.12,23.15 v16.42,23.13 | 12.94,16.08 13.07,16.08 v13.06,16.73 | M5.P$3 16.72,20.74 | U4.P$10 13.63,16.08 C11.2 | M4.P$3 17.99,9.69 v17.91,9.69 | v6.8,20.23 6.96,20.29 R20.2 | v12.34,20.74 v12.35,20.74 | 21.03,17.03 21.23,17.03 C24.2 | C1.1 4.45,20.46 v5.16,20.77
  Top 0.457: U3.2 11.15,9.02 11.37,9.19 C10.2 11.74,9.57 11.96,9.77 13.06,9.77 13.27,9.74 | 6.53,12.23 6.89,11.95 C3.2 | 16.72,20.74 v16.46,20.59 | 7,9.68 v7.01,10.1 | 13.46,8.96 13.89,9.56 13.27,9.74 | 13.27,9.74 v13.46,8.88 | M3.P$1 22.4,16.96 v22.12,17.16 21.41,16.96 21.03,17.03 21.03,17.34 21.92,17.39 21.06,17.39 21.69,17.82 23.42,17.82 23.7,17.54 23.7,17.03 23.65,16.98 22.55,16.98 21.87,17.67 21.87,18 22,18.12 23.42,17.85 23.39,18.15 23.29,19.22 23.27,18.33 22.17,18.33 22.38,18.53 22.73,18.53 22.58,18.68 22.58,19.75 22.63,19.8 22.81,20.01 23.11,19.5 v22.96,18.53
  Top 0.508: v34.87,12.28 34.59,12.33
  Top 0.61: 3.3,18.69 C2.1 | C18.1 24.84,9.5 v25.02,9.46 | C19.1 v23.37,20.89 | C12.1 16.74,13.72 C22.-
  Top 0.66: C2.1 4.99,20.64 v5.16,20.77
  Top 0.711: C20.2 25.67,21.63 v25.25,21.63 | C21.2 32.44,10.11 v32.44,10.38
  Top 0.813: C17.1 25.17,8.41 v25.68,8.5 | C16.1 23.11,18.91 v22.96,18.53 | M2.P$1 32.96,13.5 32.94,13.48 32.94,12.97 33.68,12.23 34.59,12.33 35.05,12.79 35.05,13.1 35,13.15 34.75,12.89 33.68,12.89 | C23.2 v33.33,20.64 v32.26,20.64
  Bottom 0.203: 14.07,12.7 13.97,12.41 | NTC.1 20.94,10.87 21.21,11.14 21.44,12.64 v21.34,12.82
  Bottom 0.254: 13.06,12.23 U2.P$12
  Bottom 0.305: 12.93,13.48 12.93,14.24 v13.11,14.39 | C5.2 U$4.P$4
  Bottom 0.356: U$100.P$2 3.98,21.17 v4.45,21.15 4.04,21.37 C6.2 | R4.1 4.24,8.5 4.17,8.8 v3.15,9.87 | U$4.P$4 4.93,15.9
  Bottom 0.406: U2.P$13 U2.P$14 | 4.93,15.9 arc-90 U$6.P$3
  Bottom 0.508: C7.2 14.07,12.7 | v13.11,14.39 12.65,13.93
  Bottom 0.61: 13.97,12.41 v14.25,12.69 | v14.3,11.98 14.28,12.69 14.05,11.88 | C4.2 3.17,15.93 C5.2
  Bottom 0.711: C4.2 4.78,17.74 5.16,18.2 v5.16,20.77
  Bottom 0.914: v4.9,10.81 4.96,10.39 5.38,10.25 4.95,10.79 4.78,10.48 4.7,11.29 C8.1
  Bottom 1.118: U2.P$13 13.06,12.23 13.06,12.77 12.93,13.48
  other vias: 33.78,13.83 32.97,13.83 32.97,12.89 34.16,12.21 33.78,12.89 34.52,12.94 35.28,12.94 21.18,17.44 21.79,17.85 22.25,18.51 22.58,17.87 23.39,17.85 23.01,17.16 25.12,20.82 25.3,22.67 26.49,22.65 27.76,22.65 28.4,21.63 29.69,21.53 29.01,22.57 30.2,22.54 30.96,21.45 31.52,22.49 32.28,21.43 32.77,22.47 33.76,21.45 31.88,19.06 34.87,20.08 35.15,18.61 33.96,19.42 26.7,8.42 27.94,8.42 29.21,8.4 30.43,8.37 31.8,8.37 34.14,11.45 25.55,12.79 25.17,12.03 25.1,11.06 30.96,12.79 32.03,11.24 9.58,17.54 7.98,4.55 11.15,4.55 7.92,1.75 9.88,1.73 11.57,1.73 13.89,1.55 16.08,1.57 7.37,29.04 9.79,29.12 12.16,29.06 13.74,29.07 16,29.14 15.95,26.27 12.93,26.24 13.5,12.84 26.06,17.87 34.21,10.53 5.38,10.3 11.3,16.9 8.99,15.2 9.35,14.13 7.75,18.71 1.47,15.94 1.75,12.66 19.96,19.19 9.53,18.33 23.75,17.13 22.61,19.12 34.52,13.78 35.23,13.76 33.38,12.16
  pour Route2 (isolate 0.203, no thermals): 0.4,21.02 0.43,9.76 arc-90 2.81,7.4 33.72,7.4 arc-90 36.13,9.81 36.1,9.83 36.1,21.02 arc-90 33.72,23.4 2.78,23.43 arc-90
  pour Route15 (isolate 0.203, rank 2, no thermals): 0.4,21 0.4,9.8 arc-90 2.8,7.4 33.7,7.4 arc-90 36.1,9.8 36.1,21 arc-90 33.7,23.4 2.8,23.4 arc-90
  pour Route2 (isolate 0.203, no thermals): 7.2,23.4 7.2,30.3 16.6,30.3 16.6,23.4
  pour Route15 (isolate 0.203, no thermals): 7.2,23.4 7.2,30.3 16.6,30.3 16.6,23.4
  pour Route15 (isolate 0.203, rank 2, no thermals): 7.2,7.4 7.2,0.5 16.6,0.5 16.6,7.4
  pour Route2 (isolate 0.203, no thermals): 7.2,7.4 7.2,0.5 16.6,0.5 16.6,7.4
  pour Route3 (isolate 0.203, rank 2, no thermals): 0.37,21 0.37,9.8 arc-90 2.77,7.4 33.67,7.4 arc-90 36.07,9.8 36.07,21 arc-90 33.67,23.4 2.77,23.4 arc-90
  pour Route3 (isolate 0.203, no thermals): 7.2,23.4 7.2,30.3 16.6,30.3 16.6,23.4
  pour Route3 (isolate 0.203, rank 2, no thermals): 7.2,7.4 7.2,0.5 16.6,0.5 16.6,7.4
  pour Top (no thermals): 35.48,14.11 32.66,14.11 32.51,13.96 32.33,13.78 32.33,12.99 32.33,12.92 33.22,12.03 33.35,11.9 34.39,11.9 34.67,11.9 34.95,12.18 35.48,12.71
GND_2  (via drill 0.3, 0.4)
  Top 0.305: U$3.P$2 42.83,15.89 43.06,15.76
  Top 0.406: 43.06,15.76 43.29,15.61 v43.34,15.41
  Bottom 0.305: U10.P$13 42.59,19.07 C15.2 | U10.P$20 47.78,16.39 C14.2
  Bottom 0.33: U10.P$13 42.59,17.25 43.26,16.58 | U10.P$20 46.05,16.39 v45.04,15.38
  Bottom 0.406: 43.26,16.58 44.05,16.58 v44.2,16.4 | U10.P$25 44.21,14.43 v44.2,14.47
  other vias: 39.38,17.34 39.3,15.59 39.33,13.17 42.42,11.7 43.72,11.67 45.78,11.75 47.94,13.71 40.54,13.17
  pour Route15 (isolate 0.203): 38.72,20.41 38.72,10.4 49.71,10.4 49.71,20.41
  pour Route2 (isolate 0.203): 39,20.13 38.94,10.63 49.43,10.68 49.43,20.16
IN_AP2112
  Top 0.406: U3.1 10.01,8.09 9.63,8.45 9.63,9.52 10.08,9.96 U3.3
  Top 0.457: C10.1 11.75,8.24 B2.1
  Top 0.508: U3.1 11.27,8.06 C10.1
  Top 0.61: 11.59,8.23 C10.1
JTCK  (via drill 0.3)
  Top 0.203: U1.24 7.54,17.15 7.54,17.57 7.19,17.92 7.19,18.58 v7.09,18.68
  Bottom 0.203: U$5.P$2 6.27,22.55 6.27,19.5 v7.09,18.68
JTMS  (via drill 0.3)
  Top 0.203: U1.23 7.69,16.65 7.95,16.91 7.95,18.02 v7.9,18.07
  Bottom 0.203: U$5.P$4 4.22,22.01 4.88,21.45 5.59,21.45 5.87,21.17 5.87,18.94 5.89,18.91 6.66,18.05 7.87,18.05 v7.9,18.07
LED_BLUE
  Top 0.203: R8.1 4.53,12.05 U1.12
LED_GREEN
  Top 0.203: U1.11 4,12.45 3.51,11.93 R7.1
LED_RED
  Top 0.152: 3.5,12.97 3.5,12.49 3.35,12.33 2.85,12.33 2.08,11.57 1.57,11.57 1.35,11.8 1.35,12.27 R6.1
  Top 0.203: 3.5,12.97 U1.10
M1-OUT  (via drill 0.25)
  Top 0.406: M1.P$3 14.88,8.3 v14.9,9.4
  Bottom 0.203: 10.44,7.61 10.64,7.41 12.52,7.41 12.98,7.81
  Bottom 0.254: U2.P$16 14.17,10.71 | 12.98,7.81 14.43,8.73 14.71,8.96 v14.9,9.4
  Bottom 0.305: 14.17,10.71 14.57,10.71 R3.2
  Bottom 0.356: R5.2 8.01,7.61 10.44,7.61 | 15.09,10.73 15.16,10.61 15.19,10.02 arc-37 v14.9,9.4
  Bottom 0.406: 15.09,10.73 14.66,10.79 14.17,10.71 | 14.6,13.56 14.91,13.25 14.96,12.03 14.96,11.22
  Bottom 0.457: 14.99,10.91 15.09,10.73
  Bottom 0.61: C7.1 14.14,13.61 14.6,13.56 | 14.96,11.22 14.99,10.91
M2-OUT
  Top 0.711: U$1.P$1 26.7,19.8 C20.1
  Top 0.813: M2.P$8 29.74,13.51 29.74,13.83
  Top 1.422: 29.74,13.83 30.1,14.19 | 30.1,14.19 30.1,13.76 29.59,13.76 29.59,18.18 29.59,19.7 | 30.1,14.19 30.1,14.77 M2.P$7 M2.P$6 M2.P$5
  Top 1.93: 30.1,14.19 30.1,19.7 30.4,19.7 | U$1.P$1 26.93,19.06 28.5,19.06 arc-57 29.59,18.18
M3-OUT
  Top 0.711: C21.1 30.4,10.65 U$2.P$1
  Top 0.813: M3.P$8 27.53,16.65 arc-90 27.65,16.56 M3.P$7 | 27.56,16.55 arc-90 27.65,15.24 M3.P$6 | 27.56,12.82 arc-90 27.65,12.95 M3.P$5
  Top 1.93: 27.53,16.65 27,16.7 27,11.93 26.98,11.83 27.58,15.36 27.56,16.55 27.56,12.82 27.08,14.54 27.15,14.01 arc90 29.96,11.3 U$2.P$1
M4-OUTA
  Top 0.406: M4.P$7 22.36,10.33 22.71,10.43
  Top 0.457: 22.71,10.43 25.15,10.43 26.47,9.11 32.69,9.11 33.37,9.91 R13.2
M4-OUTA-IN
  Top 0.457: M2.P$2 34.58,14.82 32.66,14.82 31.77,14.01 31.77,12.65 33.11,11.37 R13.1
M4-OUTB
  Top 0.406: 21.69,8.83 21.69,8.84 M4.P$5
  Top 0.457: R14.2 34.92,9.88 34.01,9.05 32.92,7.56 22.45,7.56 21.69,8.32 21.69,8.83
M4-OUTB-IN
  Top 0.457: M2.P$4 35.49,17.3 36,16.8 36,12.34 R14.1
M5-OUTA
  Top 0.305: M5.P$7 20.71,21.41 21.25,21.7
  Top 0.457: 21.25,21.7 R15.2
M5-OUTA-IN
  Top 0.457: R15.1 24.08,20.53 24.08,18.2 24.46,17.82 24.46,16.86 23.64,16.04 M3.P$2
M5-OUTB  (via drill 0.3, 0.35)
  Top 0.203: M5.P$5 20.22,20.09 | 24.89,19.73 R16.2
  Top 0.457: 20.22,20.09 v20.6,19.39 | v24.89,20.16 24.89,19.73
  Bottom 0.457: v20.6,19.39 21.49,20.16 v24.89,20.16
M5-OUTB-IN
  Top 0.203: R16.1 24.92,18.62
  Top 0.356: 25.35,18.18 25.48,18.06 25.48,13.76 25.45,13.73 25.43,13.73
  Top 0.457: 24.92,18.62 25.35,18.18 | M3.P$4 23.1,13.5 23.5,13.1 24.69,13.1 25.43,13.73
MPM3610_AGND
  Bottom 0.254: R1.1 11.44,8.69 11.25,8.93 U2.P$3
MPM3610_EN
  Bottom 0.254: U2.P$17 14.19,10.21
  Bottom 0.305: 14.19,10.21 14.37,10.1 R3.1
MPM3610_FB
  Bottom 0.254: U2.P$1 12.55,8.54 | R2.1 10.99,8.04 11.2,7.81 12.32,7.81 12.49,8.16 R1.2
  Bottom 0.305: 12.55,8.54 R1.2
MPM3610_SW
  Bottom 0.356: 10.54,9.39 10.57,9.29 U2.P$4
  Bottom 0.61: U2.P$5 10.11,9.65 10.11,9.39 10.54,9.39
  Bottom 1.118: U2.P$6 9.22,9.72 8.94,10.25 10.19,10.25 9.86,9.64 9.32,9.64 9.39,9.71 U2.P$5
N$1
  Top 0.203: RGB.P$4 0.76,10.9 R6.2
N$4
  Top 0.203: R7.2 3.6,10.25 RGB.P$3
N$5
  Top 0.203: R8.2 5.48,9.43 RGB.P$2
N$17
  Bottom 0.305: U10.P$21 47.87,15.74 R17.1
OUT_MPM3610  (via drill 0.4)
  Top 0.305: B2.2 12.77,7.46
  Top 0.356: 12.77,7.46 9.42,7.46 8.94,7.94 v8.94,8.52
  Bottom 0.305: v8.94,8.52 8.79,8.65 8.52,8.56
  Bottom 0.356: 10.16,12.54 10.56,12.55 U2.P$9
  Bottom 0.61: R2.2 8.79,8.43 8.52,8.56 7.8,9.18 7.8,11.03 U2.P$7
  Bottom 0.813: 8,12.23 C8.2
  Bottom 1.016: 10.31,12.64 9.42,12.66 10.16,12.54
  Bottom 1.118: 9.12,12.44 9.39,12.58 8,12.23 | 9.12,12.44 9.02,12.49 10.16,12.54 | 10.16,12.54 10.31,12.64 | 10.16,12.54 U2.P$8 | U2.P$7 9.21,12.35 9.12,12.44
PWM-1  (via drill 0.3)
  Top 0.203: M5.P$4 17.2,20.09 16.28,19.17 14.71,19.17 11.94,16.4 v11.79,16.4 | U1.18 7.22,14.11 v8.69,14.11
  Bottom 0.203: v11.79,16.4 11.61,16.4 11.07,15.87 10.59,15.87 9.37,14.64 9.07,14.64 8.69,14.26 v8.69,14.11
PWM-2  (via drill 0.3)
  Top 0.203: M5.P$2 16.34,21.39 14.76,19.8 13.44,19.8 v10.62,16.98 | U1.21 7.22,15.69 9.42,15.69 v9.53,15.59
  Bottom 0.203: v10.62,16.98 10.62,16.65 9.55,15.59 v9.53,15.59
PWM-3
  Top 0.203: U1.19 11.02,14.65 12.06,13.6 12.06,12.26 13.54,10.79 15.82,10.79 17.68,8.93 18.78,8.93 M4.P$4
PWM-4
  Top 0.203: U1.22 9.75,16.15 10.79,15.1 11.15,15.1 12.98,13.25 12.98,12.56 14.02,11.47 16.36,11.47 16.48,11.34 17.53,10.4 18.76,10.4 M4.P$2
RS485_N  (via drill 0.25)
  Top 0.178: v20.78,7.96 20.91,7.89 20.76,7.75 16.24,7.75 15.43,6.94 11.49,6.94 9.73,4.82 v9.6,4.87 | v15.22,22.42 15.33,22.42 15.33,22.31 14.93,21.94 14.38,21.94 14.24,22.04 U5.P$7
  Bottom 0.178: v20.78,7.96 20.91,7.89 21.45,8.97 arc44 21.71,10.1 arc-19 21.71,11.83 21.85,12.72 21.86,12.8 arc64 20.39,17.01 arc-43 19.09,19.3 arc-14 19.09,19.4 arc38 18.79,20.36 arc54 16.18,21.72 15.81,21.72 15.35,22.17 15.35,22.33 arc117 v15.22,22.42 | U$8.P$3 10.9,3.6 v9.6,4.87 | 15.35,22.44 v15.22,22.42 | U$9.P$3 13.73,26.77 13.73,26.41 arc41 14.18,25.2 arc-29 15.35,22.82 15.35,22.42 v15.22,22.42
RS485_P  (via drill 0.25)
  Top 0.178: U$8.P$4 8.9,3.26 11.65,6.61 15.56,6.61 16.38,7.42 20.91,7.42 21.22,7.73 v21.32,7.68 | v15.82,22.37 15.68,22.37 15.68,22.2 15.08,21.59 14.41,21.59 14.21,21.39 U5.P$6
  Bottom 0.178: v21.32,7.68 21.21,7.71 21.73,8.79 arc44 22.03,10.15 arc-19 22.04,11.77 22.18,12.67 22.18,12.73 arc64 20.6,17.26 arc-43 19.42,19.34 arc0 19.42,19.39 arc38 19.06,20.56 arc54 16.18,22.05 15.94,22.05 15.82,22.17 v15.82,22.37 | 15.68,22.37 v15.82,22.37 | U$9.P$4 14.06,26.76 14.06,26.41 arc41 14.43,25.42 arc-29 15.69,22.88 15.69,22.36 v15.82,22.37
SEL_SERIAL
  Top 0.203: U1.28 5.03,18.2 6.02,19.19 9.35,19.19 10.26,20.11 10.26,21.15 10.02,21.39 9.37,21.39 U5.P$3 | U5.P$3 9.4,21.39 | R20.1 8.24,20.88 8.76,21.4 8.91,21.4 | 8.91,21.4 9.32,21.4 U5.P$3 | U5.P$2 9.07,22.04 8.91,21.88 8.91,21.4
SPI_CLK  (via drill 0.3)
  Top 0.152: U1.9 2.88,13 1.91,12.03 v1.83,12.03
  Bottom 0.152: 3.5,13.83 3.5,13.63 2.06,12.18 1.91,12.03 1.85,12.03 v1.83,12.03
  Bottom 0.203: 3.5,13.83 3.5,14.11 3.79,14.4 U$4.P$1
SPI_CLK_2  (via drill 0.3)
  Top 0.203: U$3.P$5 41.13,14.39 v40.58,13.84
  Bottom 0.203: U10.P$10 arc55 41.03,15.43 R19.2 40.5,13.93 v40.58,13.84
SPI_IN  (via drill 0.3)
  Top 0.203: U1.7 arc-90 2.37,14.14 1.88,14.14 1.68,13.93 v1.4,13.93
  Bottom 0.203: U$4.P$3 3.55,15.4 2.08,13.93 v1.4,13.93
SPI_IN_2  (via drill 0.3)
  Top 0.203: U$3.P$3 41.62,15.39 40.49,16.51 v40.49,16.75
  Bottom 0.203: R18.2 40.49,16.61 v40.49,16.75
  Bottom 0.305: U10.P$11 40.73,16.39 R18.2
SPI_OUT  (via drill 0.3)
  Top 0.203: U1.8 1.9,13.65 v1.52,13.27
  Bottom 0.203: U$6.P$2 6.22,15.71 6.22,15.13 5.66,14.67 4.8,14.67 4.5,14.82 4.18,14.82 U$4.P$2 3.71,14.9 2.21,13.38 1.63,13.38 v1.52,13.27
SPI_OUT_2  (via drill 0.3)
  Top 0.203: U$3.P$4 40.92,14.89 39.96,15.85 39.96,17.08 40.56,17.63 v41.61,17.63
  Bottom 0.305: U10.P$12 41.66,17.19 v41.61,17.63
USART1_RX
  Top 0.203: U1.30 4.03,18.73 6.62,21.29 7.85,21.29 8.51,21.95 8.51,22.41 8.79,22.7 U5.P$1
USART1_TX
  Top 0.203: U1.29 4.53,18.46 5.74,19.68 8.27,19.68 U5.P$4
V_BAT  (via drill 0.25)
  Top 0.203: 6.03,11.64 v6.1,11.57 5.89,11.8 5.89,12.41 6.03,12.57 U1.15
  Bottom 0.254: 6.06,8.54 6.35,8.83 6.35,11.32 v6.1,11.57
  Bottom 0.356: R5.1 6.06,8.54
  Bottom 0.406: R4.2 R5.1
V_CORRIENTE  (via drill 0.3)
  Top 0.203: U1.14 5.53,11.86 arc39 5.74,11.27 5.92,11.09 7.75,11.09 9.02,12.36 9.02,13.27 v9.09,13.53 | 12.41,15.38 C11.1 12.11,15.66 v11.76,15.66
  Top 0.406: C11.1 13.59,15.08 13.82,14.85 13.82,14 R10.1
  Bottom 0.203: v11.76,15.66 9.65,13.55 9.12,13.55 v9.09,13.53
V_TEMP  (via drill 0.3)
  Top 0.203: U1.13 5.03,11.44 5.79,10.68 8.19,10.68 R9.1 9.8,12.3 9.8,13.58 10.34,14.11 10.9,14.11 11.43,13.58 11.43,11.85 13.01,10.28 13.84,10.18 15.72,10.18 17.63,8.27 v20.14,8.27
  Bottom 0.203: NTC.2 arc-90 21.11,10.08 21.11,9.23 v20.14,8.27
VDDA-FILTRADO  (via drill 0.3)
  Top 0.305: U1.5 1.34,15.15 B1.1 1.08,15.41 v1.52,15.28
  Bottom 0.508: C4.1 2.17,16.12 C5.1 2.14,15.64 1.78,15.28 v1.52,15.28

### Text on the board
tNames: M5 | U1 | U4 | M3 | M4 | M2 | U3 | RGB
bNames: U10 | U2
tDocu: +5V | GND | B | A | JTMS | GND | JTCK | 3V3 | <-8.15mm-> | FFC-0.5 | 2mm-> | <-7.4mm-> | GND | A | B | +5V
bDocu: +5V | GND | B | A | 8MHz | FFC-0.5 | GND | 3V3 | POT | A | B | GND | +5V | JLCJLCJLCJLC